# Altium project gbpp.PrjPcb
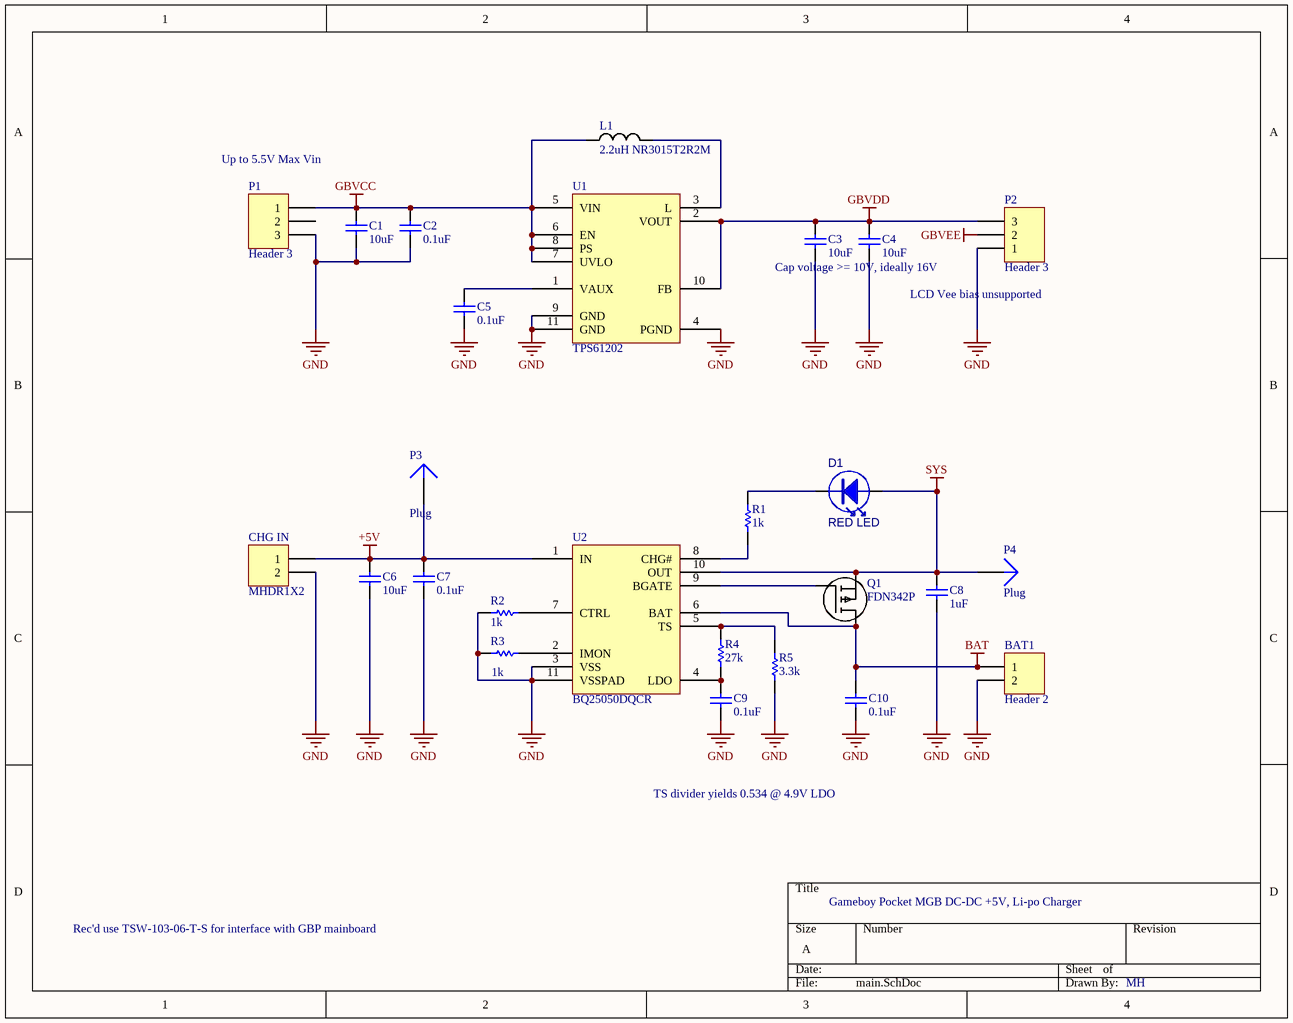
[diagram p0: main.SchDoc]
1 sheet, 26 parts. Net scope: global (net labels, ports and power ports of the same name join across sheets).
Board file: main.PcbDoc

## Sheet main.SchDoc
size A

### Parts
BAT1  Header 2  [HDR1X2]  (no BOM)
C1  10uF  [CAPC0805(2012)130_N]
C2  0.1uF  [CAPC0603(1608)100_N]
C3  10uF  [CAPC0805(2012)130_N]
C4  10uF  [CAPC0805(2012)130_N]
C5  0.1uF  [CAPC0603(1608)100_N]
C6  10uF  [CAPC0805(2012)130_N]
C7  0.1uF  [CAPC0603(1608)100_N]
C8  1uF  [CAPC0603(1608)100_N]
C9  0.1uF  [CAPC0603(1608)100_N]
C10  0.1uF  [CAPC0603(1608)100_N]
CHG_IN  MHDR1X2  [MHDR1X2]  (no BOM)
D1  RED LED  [LED_0603]
L1  2.2uH NR3015T2R2M  [IND_3x3_SMD]
P1  Header 3  [HDR1X3]
P2  Header 3  [HDR1X3]
P3  Plug  [PIN1]  (no BOM)
P4  Plug  [PIN1]  (no BOM)
Q1  FDN342P  [SOT-23]
R1  1k  [RESC0603(1608)_N]
R2  1k  [RESC0603(1608)_N]
R3  1k  [RESC0603(1608)_N]
R4  27k  [RESC0603(1608)_N]
R5  3.3k  [RESC0603(1608)_N]
U1  TPS61202  [DRC10_TI]
U2  BQ25050DQCR  [TI_WSON10]

### Nets
+5V: C6.1 C7.1 CHG_IN.1 P3.1 U2.1(IN)
BAT: BAT1.1 C10.1 Q1.3 U2.6(BAT)
GBVCC: C1.1 C2.1 L1.1 P1.1 U1.5(VIN) U1.6(EN) U1.7(UVLO) U1.8(PS)
GBVDD: C3.1 C4.1 P2.3 U1.2(VOUT) U1.10(FB)
GBVEE: P2.2
GND: BAT1.2 C1.2 C2.2 C3.2 C4.2 C5.2 C6.2 C7.2 C8.2 C9.2 C10.2 CHG_IN.2 P1.3 P2.1 R2.2 R3.1 R5.1 U1.4(PGND) U1.9(GND) U1.11(GND) U2.3(VSS) U2.11(VSSPAD)
SYS: C8.1 D1.2(A) P4.1 Q1.2 U2.10(OUT)
NetC5_1: C5.1 U1.1(VAUX)
NetC9_1: C9.1 R4.2 U2.4(LDO)
NetD1_1: D1.1(K) R1.1
NetL1_2: L1.2 U1.3(L)
NetQ1_1: Q1.1 U2.9(BGATE)
NetR1_2: R1.2 U2.8(CHG#)
NetR2_1: R2.1 U2.7(CTRL)
NetR3_2: R3.2 U2.2(IMON)
NetR4_1: R4.1 R5.2 U2.5(TS)

Not connected (* = marked no-connect by the designer): P1 2

### Notes on the sheet
- Up to 5.5V Max Vin
- Cap voltage >= 10V, ideally 16V
- LCD Vee bias unsupported
- TS divider yields 0.534 @ 4.9V LDO
- Gameboy Pocket MGB DC-DC +5V, Li-po Charger
- Rec'd use TSW-103-06-T-S for interface with GBP mainboard
- MH

### Library data of the parts
BAT1 = Header 2: Header, 2-Pin; LatestRevisionDate: 17-Jul-2002; LatestRevisionNote: Re-released for DXP Platform.; Publisher: Altium Limited
C1-C10 = CAP: Capacitor Ceramic
CHG_IN = MHDR1X2: Header, 2-Pin; LatestRevisionDate: 17-Jul-2002; LatestRevisionNote: Re-released for DXP Platform.; Publisher: Altium Limited
D1 = LED: LED OPTO
L1 = IND_PWR: Power Inductor SMD
P1 P2 = Header 3: Header, 3-Pin; LatestRevisionDate: 17-Jul-2002; LatestRevisionNote: Re-released for DXP Platform.; Publisher: Altium Limited
Q1 = TRANSISTOR PCH FET: P CHANNEL FET; Manufacturer: Fairchild Semiconductor; Manufacturer Part Number: 2N7002; Drain to Source Voltage (Vdss): 60V; Vgs(th) (Max) @ Id: 2.5V @ 250µA; Power - Max: 200mW; Current - Continuous Drain (Id) @ 25° C: 115mA; Rds On (Max) @ Id, Vgs: 7.5 Ohm @ 500mA, 10V; FET Type: MOSFET N-Channel, Metal Oxide; FET Feature: Logic Level Gate; Input Capacitance (Ciss) @ Vds: 50pF @ 25V; Reel: Q2; Supplier 1: Digi-Key; Supplier Part Number 1: 2N7002NTR-ND; Package / Case: SOT-23-3, TO-236-3, Micro3™, SSD3, SST3; RoHS: RoHS Compliant; Mounting Type: Surface Mount; Packaging: Tape & Reel (TR); Gate Charge (Qg) @ Vgs: -; Supplier Part Number: 2N7002NTR-ND; Supplier: Digi-Key; Category: Discrete Semiconductor Products
R1-R5 = RES: Resistor SMD
U1 = TPS61200: Buck-Boost Regulator
U2 = bq25050: IC BATT CHG LI-ION 1CELL 10WSON
P3 P4 = Plug: LatestRevisionDate: 17-Jul-2002; LatestRevisionNote: Re-released for DXP Platform.; Publisher: Altium Limited